# Altium schematic sheet 4_analog_circuits.schdoc: Analog Circuits
size A4; Engineer: Eng_2_ALT; Revision: v0.7; SheetNumber: 4; SheetTotal: 6; Designed by: André M. P. Mattos; Version: v0.7; ProjectCode: obdh2
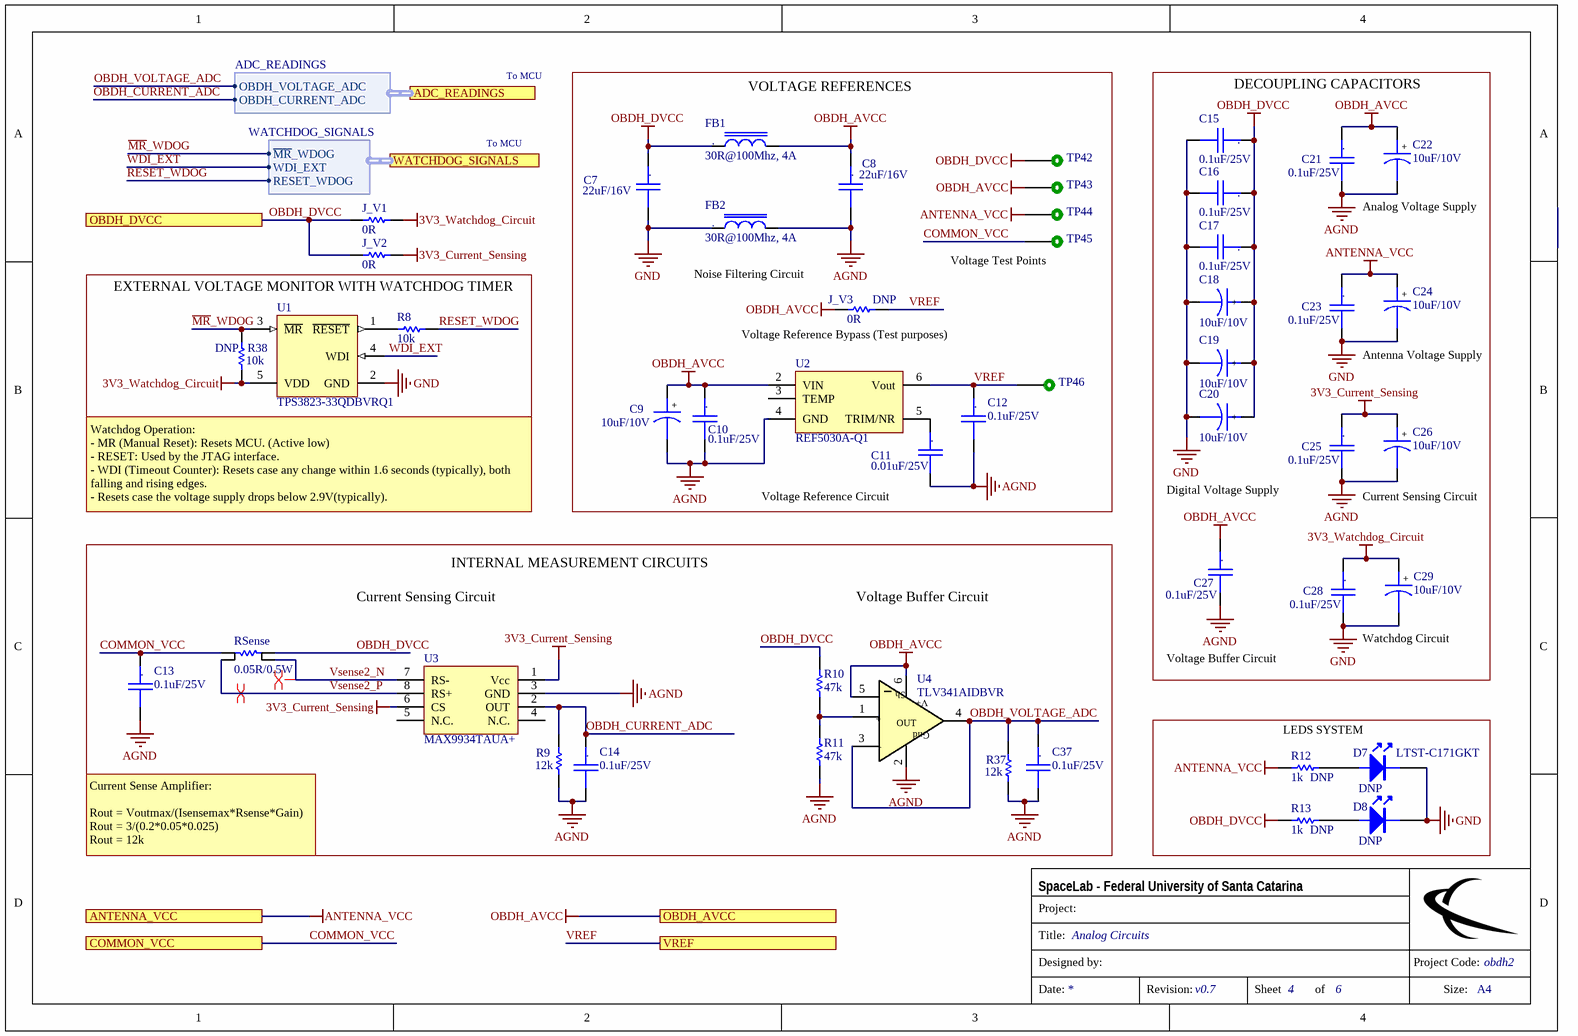
[diagram p0: 4_analog_circuits.schdoc]

## Parts
C7  22uF/16V  [CC1210]
C8  22uF/16V  [CC1210]
C9  10uF/10V  [CC0805_Tantalum]
C10  0.1uF/25V  [CC0805]
C11  0.01uF/25V  [CC0805]
C12  0.1uF/25V  [CC0805]
C13  0.1uF/25V  [CC0805]
C14  0.1uF/25V  [CC0805]
C15  0.1uF/25V  [CC0805]
C16  0.1uF/25V  [CC0805]
C17  0.1uF/25V  [CC0805]
C18  10uF/10V  [CC0805_Tantalum]
C19  10uF/10V  [CC0805_Tantalum]
C20  10uF/10V  [CC0805_Tantalum]
C21  0.1uF/25V  [CC0805]
C22  10uF/10V  [CC0805_Tantalum]
C23  0.1uF/25V  [CC0805]
C24  10uF/10V  [CC0805_Tantalum]
C25  0.1uF/25V  [CC0805]
C26  10uF/10V  [CC0805_Tantalum]
C27  0.1uF/25V  [CC0805]
C28  0.1uF/25V  [CC0805]
C29  10uF/10V  [CC0805_Tantalum]
C37  0.1uF/25V  [CC0805]
D7  DNP  [0805-LED]
D8  DNP  [0805-LED]
FB1  30R@100Mhz, 4A  [IND0805]
FB2  30R@100Mhz, 4A  [IND0805]
J_V1  0R  [0805]
J_V2  0R  [0805]
J_V3  0R  [0805]
R8  10k  [0805]
R9  12k  [0805]
R10  47k  [0805]
R11  47k  [0805]
R12  1k  [0805]
R13  1k  [0805]
R37  12k  [0805]
R38  10k  [0805]
RSense  0.05R/0.5W  [1206 - ohmite]
TP42  TEST_POINT_2  [TEST_POINT_2]  (value not drawn)  (no BOM)
TP43  TEST_POINT_2  [TEST_POINT_2]  (value not drawn)  (no BOM)
TP44  TEST_POINT_2  [TEST_POINT_2]  (value not drawn)  (no BOM)
TP45  TEST_POINT_2  [TEST_POINT_2]  (value not drawn)  (no BOM)
TP46  TEST_POINT_2  [TEST_POINT_2]  (value not drawn)  (no BOM)
U1  TPS3823-33QDBVRQ1  [DBV0005A_N]
U2  REF5030A-Q1  [SOIC-8]
U3  MAX9934TAUA+  [MSOP-8]
U4  TLV341AIDBVR  [SOT-23 6L]

## Blocks framed on the sheet
VOLTAGE REFERENCES: C7-C12 FB1 FB2 J_V3 TP42-TP46 U2
DECOUPLING CAPACITORS: C15-C29
EXTERNAL VOLTAGE MONITOR WITH WATCHDOG TIMER: R8 R38 U1

## Ports
ADC_READINGS (harness ADC_READINGS), ANTENNA_VCC, COMMON_VCC, OBDH_AVCC, OBDH_DVCC, VREF, WATCHDOG_SIGNALS (harness WATCHDOG_SIGNALS)

## Harnesses
ADC_READINGS: OBDH_VOLTAGE_ADC, OBDH_CURRENT_ADC
WATCHDOG_SIGNALS: ~{MR}_WDOG, WDI_EXT, RESET_WDOG

## Nets
3V3_Current_Sensing: C25.1 C26.1 J_V2.1 U3.1(Vcc) U3.6(CS)
3V3_Watchdog_Circuit: C28.1 C29.1 J_V1.1 R38.1 U1.5(VDD)
AGND: C8.2 C9.2 C10.2 C11.2 C12.2 C13.2 C14.2 C21.2 C22.2 C25.2 C26.2 C27.2 C37.2 FB2.2 R9.1 R11.1 R37.1 U2.4(GND) U3.3(GND) U4.2(Gnd)
ANTENNA_VCC: C23.1 C24.1 R12.2 TP44.1 ; port ANTENNA_VCC
GND: C7.2 C15.2 C16.2 C17.2 C18.2 C19.2 C20.2 C23.2 C24.2 C28.2 C29.2 D7.2(K) D8.2(K) FB2.1 U1.2(GND)
OBDH_AVCC: C8.1 C9.1 C10.1 C21.1 C22.1 C27.1 FB1.2 J_V3.2 TP43.1 U2.2(VIN) U4.5(EN) U4.6(V+) ; port OBDH_AVCC
OBDH_DVCC: C7.1 C15.1 C16.1 C17.1 C18.1 C19.1 C20.1 FB1.1 J_V1.2 J_V2.2 R10.2 R13.2 RSense.2 TP42.1 ; port OBDH_DVCC
~{MR}_WDOG: R38.2 U1.3(~{MR}) ; port WATCHDOG_SIGNALS.~{MR}_WDOG
COMMON_VCC: C13.1 RSense.1 TP45.1 ; port COMMON_VCC
OBDH_CURRENT_ADC: C14.1 R9.2 U3.2(OUT) ; port ADC_READINGS.OBDH_CURRENT_ADC
OBDH_VOLTAGE_ADC: C37.1 R37.2 U4.3(-IN) U4.4(OUT) ; port ADC_READINGS.OBDH_VOLTAGE_ADC
RESET_WDOG: R8.2 ; port WATCHDOG_SIGNALS.RESET_WDOG
VREF: C12.1 J_V3.1 TP46.1 U2.6(Vout) ; port VREF
Vsense2_N: RSense.4 U3.7(RS-)
Vsense2_P: RSense.3 U3.8(RS+)
WDI_EXT: U1.4(WDI) ; port WATCHDOG_SIGNALS.WDI_EXT
NetC11_1: C11.1 U2.5(TRIM/NR)
NetD7_1: D7.1(A) R12.1
NetD8_1: D8.1(A) R13.1
NetR8_1: R8.1 U1.1(~{RESET})
NetR10_1: R10.1 R11.2 U4.1(+IN)

Not connected (* = marked no-connect by the designer): U2 3(TEMP); U3 4(N.C.) 5(N.C.)

## Layout directives
differential pair: Vsense2_N, Vsense2_P

## Notes on the sheet
- To MCU
- Analog Voltage Supply
- Noise Filtering Circuit
- (near J_V3) DNP
- (near TP45) Voltage Test Points
- (near R38) DNP
- (near J_V3) Voltage Reference Bypass (Test purposes)
- Antenna Voltage Supply
- Watchdog Operation:
  - MR (Manual Reset): Resets MCU. (Active low)
  - RESET: Used by the JTAG interface.
  - WDI (Timeout Counter): Resets case any change within 1.6 seconds (typically), both falling and rising edges.
  - Resets case the voltage supply drops below 2.9V(typically).
- (near C11) Voltage Reference Circuit
- Digital Voltage Supply
- Current Sensing Circuit
- INTERNAL MEASUREMENT CIRCUITS
- Voltage Buffer Circuit
- Watchdog Circuit
- LEDS SYSTEM
- (near R12) DNP
- (near D7) LTST-C171GKT
- Current Sense Amplifier:
  Rout = Voutmax/(Isensemax*Rsense*Gain)
  Rout = 3/(0.2*0.05*0.025)
  Rout = 12k
- (near R13) DNP
- Project:
- SpaceLab - Federal University of Santa Catarina
- Title:
- Designed by:
- Project Code:
- Date:
- Revision:
- Sheet
- of
- Size:
- A4
- (in symbol Cap_Cer_X7R_0.01uF_16V_1210) .
- (in symbol Cap_Cer_X7R_0.1uF_25V_0805) .
- (in symbol Cap_Cer_X7R_0.01uF_50V_0805) .
- (in symbol Cap_Tant_SMD_10uF_6V3_0805) +
- (in symbol Cap_Tant_SMD_10uF_10V_0805) +
- (in symbol FB_30R_4A_100MHz_0805) .
- (in symbol TLV341AIDBVR) Sh; +; -

## Library data of the parts
C7 C8 = Cap_Cer_X7R_0.01uF_16V_1210: CAP CER 22uF 16V 10% X7R 1210; Partnumber: C3225X7R1C226K250AC; NCM: 8532.24.10
C9 C18-C20 = Cap_Tant_SMD_10uF_6V3_0805: CAP Tantalum 10uF 6.3V 10% 0805; Partnumber: TPSR106K006R1000; NCM: 8532.21.11
C10 C12-C17 C21 C23 C25 C27 C28 C37 = Cap_Cer_X7R_0.1uF_25V_0805: CAP CER 0.1UF 25V 10% X7R 0805; Partnumber: CC0805KRX7R8BB104; NCM: 8532.24.10
C11 = Cap_Cer_X7R_0.01uF_50V_0805: CAP CER 0.01uF 25V 10% X7R 0805; Partnumber: CL21B103KAANNNC; NCM: 8532.24.10
C22 C24 C26 C29 = Cap_Tant_SMD_10uF_10V_0805: CAP Tantalum 10uF 10V 20% 0805; Partnumber: TPSP106M010R2000; NCM: 8532.21.11
D7 D8 = LED/G_0805: SMD Green LED; Partnumber: LTST-C171GKT; NCM: 8541.40.21
FB1 FB2 = FB_30R_4A_100MHz_0805: Ferrite Bead 30 OHM 4A 100MHz; Partnumber: BLM21PG300SN1D; NCM: 8504.50.00
J_V1-J_V3 = R0R_JUMPER_1/8W_0805: RES 0R OHM 1/8W JUMPER 0805; Partnumber: CRCW08050000Z0EA; NCM: 8533.21.20
R8 R38 = R10k_1%_1/8W_0805: RES 10K OHM 1/8W 1%  0805; Partnumber: CRCW080510K0FKEA; NCM: 8533.21.20
R9 R37 = R12k_1%_1/8W_0805: RES 12K OHM 1/8W 1%  0805; Partnumber: RC0805FR-0712KL; NCM: 8533.21.20
R10 R11 = R47k_1%_1/8W_0805: RES 47k OHM 1/8W 1% 0805; Partnumber: RC0805FR-0747KL; NCM: 8533.21.20
R12 R13 = R1.0k_1%_1/8W_0805: RES 1.0K OHM 1/8W 1% 0805; Partnumber: RC0805FR-071KL; NCM: 8533.21.20
RSense = R0.05R_0.5%_0.5W_1206: Current Sense Resistors - SMD 0.05ohm .5% 4 Terminal; Partnumber: LVK12R050DER; NCM: 8533.21.20
TP42-TP46 = TEST_POINT_2: Test point
U1 = CMP-0338-00011-2: Processor Supervisory Circuit, 1 Supply Monitored, -40 to 85 degC, 5-Pin SOT-23 (DBV), Green (RoHS & no Sb/Br); Manufacturer: Texas Instruments; Iq: 15 uA Typ.; Threshold Voltage: 2.93 V Typ.; Watchdog Timer WDI: 0.2 s; VCC: 1.1 V Min.; Reset Threshold Accuracy: 2.4%; Rating: Catalog; Time Delay: 25 ms; # of Supplies Monitored: 1; Output Driver Type / Reset Output: Active-low, Push-pull; Packing: Tape and Reel; ComponentLink1Description: Manufacturer URL; RoHS: TRUE; PackageDescription: 5-Pin Plastic Small Outline, Body 1.6 x 2.9 mm, Pitch 0.95 mm; Mounting Technology: Surface Mount; ComponentLink1URL: www.ti.com; PackageReference: DBV0005A; ComponentLink3URL: http://www.ti.com/lit/ml/mpds018j/mpds018j.pdf; ComponentLink3Description: Package Specification; PartNumber: TPS3823-33QDBVRQ1; DatasheetVersion: SLVS165J; ComponentLink2Description: Datasheet; PackageVersion: 4073253-4/L; ComponentLink2URL: http://www.ti.com/lit/ds/symlink/tps3820-33.pdf; Operating Temperature Range: -40 to 85 degC
U2 = REF5030A-Q1: Partnumber: REF5030A-Q1
U3 = MAX9934TAUA+: Partnumber: MAX9934TAUA+
U4 = TLV341AIDBVR: Partnumber: TLV341AIDBVR